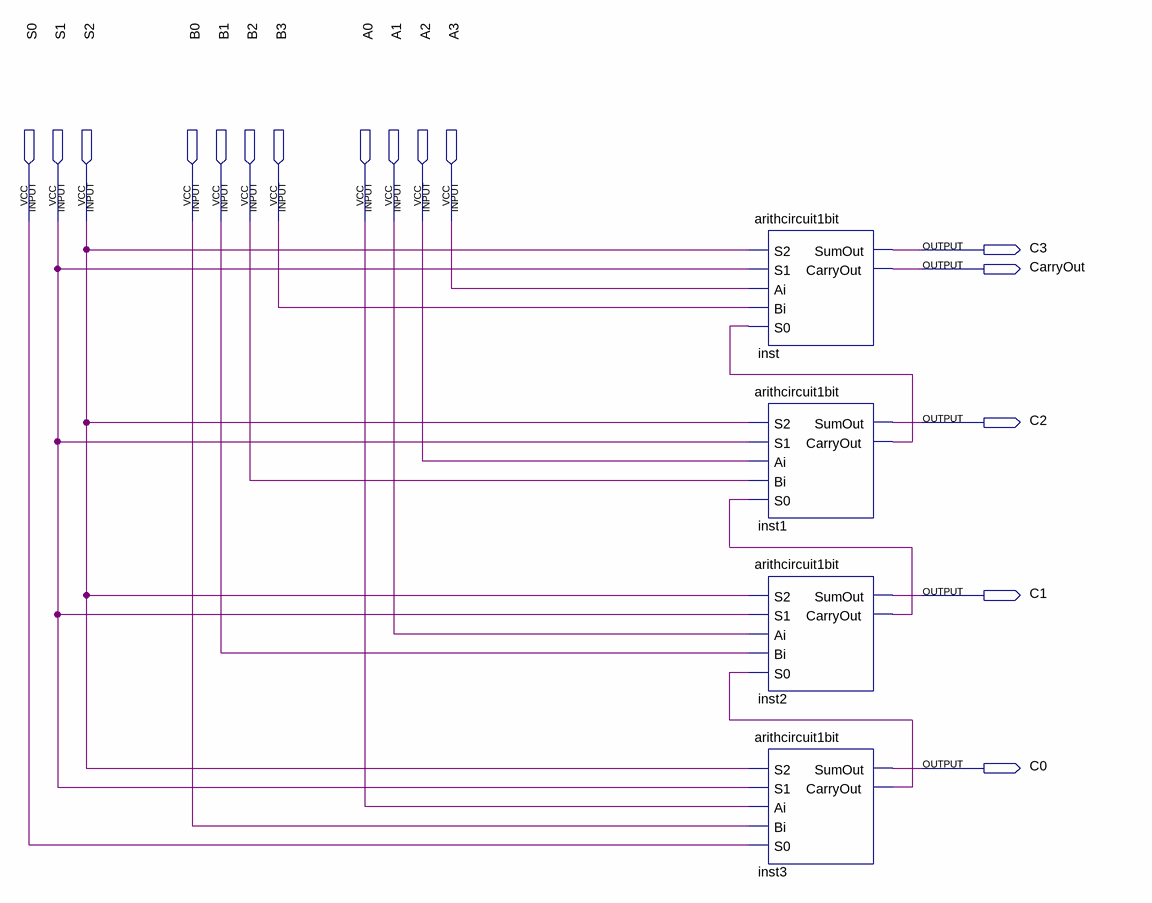
[diagram p0: schematic sheet]
// Quartus schematic arithcicuit4bit.bdf as structural Verilog: 4 symbols, 16 pins
module arithcicuit4bit (
  input  S0,
  input  S1,
  input  S2,
  input  B0,
  input  B1,
  input  B2,
  input  B3,
  input  A0,
  input  A1,
  input  A2,
  input  A3,
  output C3,
  output CarryOut,
  output C2,
  output C1,
  output C0
);

  wire inst1_carryout, inst2_carryout, inst3_carryout;

  arithcircuit1bit inst (.S2(S2), .S1(S1), .Ai(A3), .Bi(B3), .S0(inst1_carryout), .SumOut(C3), .CarryOut(CarryOut));
  arithcircuit1bit inst1 (
    .S2(S2), .S1(S1), .Ai(A2), .Bi(B2), .S0(inst2_carryout), .SumOut(C2), .CarryOut(inst1_carryout));
  arithcircuit1bit inst2 (
    .S2(S2), .S1(S1), .Ai(A1), .Bi(B1), .S0(inst3_carryout), .SumOut(C1), .CarryOut(inst2_carryout));
  arithcircuit1bit inst3 (.S2(S2), .S1(S1), .Ai(A0), .Bi(B0), .S0(S0), .SumOut(C0), .CarryOut(inst3_carryout));
endmodule
